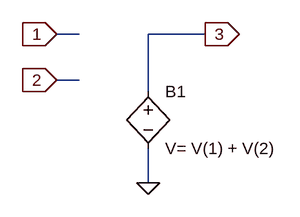
[diagram p0: schematic Adder.asc]
Adder.asc, the LTspice schematic file:
Version 4
SHEET 1 880 680
WIRE 176 112 144 112
WIRE 352 112 272 112
WIRE 176 176 144 176
WIRE 272 192 272 112
WIRE 272 320 272 272
FLAG 144 112 1
IOPIN 144 112 In
FLAG 144 176 2
IOPIN 144 176 In
FLAG 352 112 3
IOPIN 352 112 Out
FLAG 272 320 0
SYMBOL bv 272 176 R0
SYMATTR InstName B1
SYMATTR Value V= V(1) + V(2)

The netlist it stands for:
* Adder.asc
B1 3 0 V= V(1) + V(2)
.backanno
.end